# EAGLE design BLDC (EAGLE 6.2)
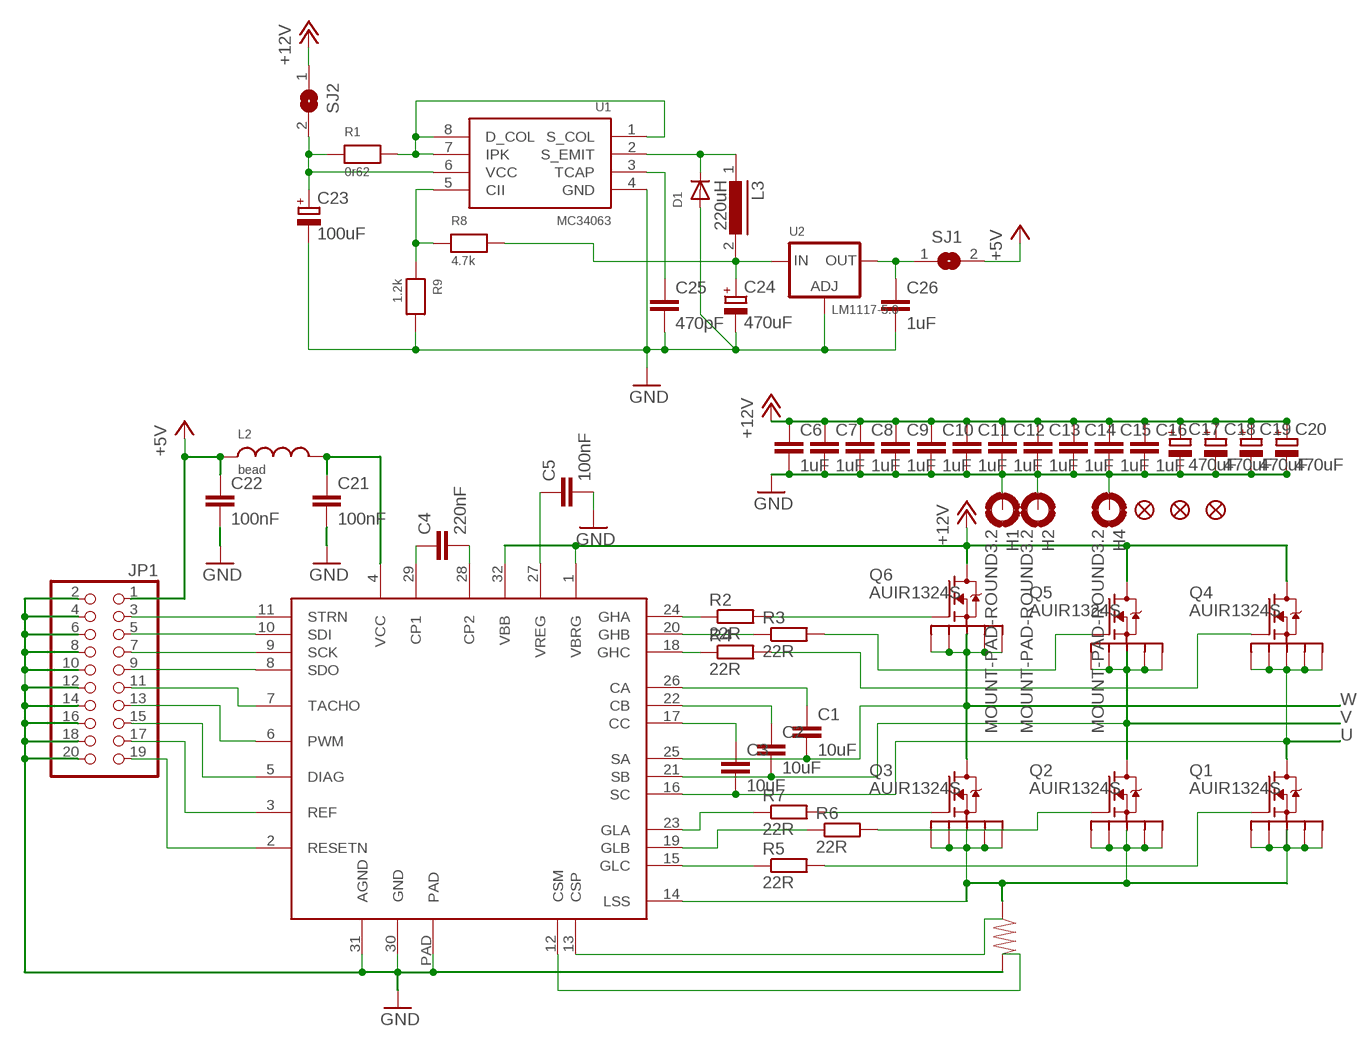
[diagram p0: schematic, sheet 1]

## Parts
C1  10uF  C-EUC0603K  [C0603K]
C2  10uF  C-EUC0603K  [C0603K]
C3  10uF  C-EUC0603K  [C0603K]
C4  220nF  C-EUC0603K  [C0603K]
C5  100nF  C-EUC0603K  [C0603K]
C6  1uF  C-EUC0603K  [C0603K]
C7  1uF  C-EUC0603K  [C0603K]
C8  1uF  C-EUC0603K  [C0603K]
C9  1uF  C-EUC0603K  [C0603K]
C10  1uF  C-EUC0603K  [C0603K]
C11  1uF  C-EUC0603K  [C0603K]
C12  1uF  C-EUC0603K  [C0603K]
C13  1uF  C-EUC0603K  [C0603K]
C14  1uF  C-EUC0603K  [C0603K]
C15  1uF  C-EUC0603K  [C0603K]
C16  1uF  C-EUC0603K  [C0603K]
C17  470uF  CPOL-EUD  [PANASONIC_D]
C18  470uF  CPOL-EUD  [PANASONIC_D]
C19  470uF  CPOL-EUD  [PANASONIC_D]
C20  470uF  CPOL-EUD  [PANASONIC_D]
C21  100nF  C-EUC0603K  [C0603K]
C22  100nF  C-EUC0603K  [C0603K]
C23  100uF  CPOL-EUD  [PANASONIC_D]
C24  470uF  CPOL-EUD  [PANASONIC_D]
C25  470pF  C-EUC0603K  [C0603K]
C26  1uF  C-EUC0603K  [C0603K]
D1  DIODESOD-123  [SOD-123]
H1  MOUNT-PAD-ROUND3.2  [3,2-PAD]
H2  MOUNT-PAD-ROUND3.2  [3,2-PAD]
H4  MOUNT-PAD-ROUND3.2  [3,2-PAD]
IC1  A4960  [LQFP32-7X7]
JP1  PINHD-2X10  [2X10]
JP2  FIDUCIAL1X2  [FIDUCIAL-1X2]
JP3  FIDUCIAL1X2  [FIDUCIAL-1X2]
JP4  FIDUCIAL1X2  [FIDUCIAL-1X2]
L2  bead  INDUCTOR0603  [0603]
L3  220uH  SLF7045  [SLF7045]
Q1  AUIR1324S  NMOSFET-D2PAK-7  [D2PAK-7]
Q2  AUIR1324S  NMOSFET-D2PAK-7  [D2PAK-7]
Q3  AUIR1324S  NMOSFET-D2PAK-7  [D2PAK-7]
Q4  AUIR1324S  NMOSFET-D2PAK-7  [D2PAK-7]
Q5  AUIR1324S  NMOSFET-D2PAK-7  [D2PAK-7]
Q6  AUIR1324S  NMOSFET-D2PAK-7  [D2PAK-7]
R1  0r62  RESISTOR0603  [0603]
R2  22R  R-EU_R0603  [R0603]
R3  22R  R-EU_R0603  [R0603]
R4  22R  R-EU_R0603  [R0603]
R5  22R  R-EU_R0603  [R0603]
R6  22R  R-EU_R0603  [R0603]
R7  22R  R-EU_R0603  [R0603]
R8  4.7k  RESISTOR0603  [0603]
R9  1.2k  RESISTOR0603  [0603]
SJ1  SOLDERJUMPERREFLOW  [SOLDERJUMPER_REFLOW]
SJ2  SOLDERJUMPERREFLOW  [SOLDERJUMPER_REFLOW]
U1  MC34063  MC34063A  [SOIC8]
U2  LM1117-5.0  LM1117SOT223-REFLOW  [SOT223-R]

## Nets
+5V: C22.1 JP1.1 L2.1 SJ1.2
+12V: C6.1 C7.1 C8.1 C9.1 C10.1 C11.1 C12.1 C13.1 C14.1 C15.1 C16.1 C17.+ C18.+ C19.+ C20.+ IC1.1(VBRG) IC1.32(VBB) Q4.D Q5.D Q6.D SJ2.1
CSM: IC1.12(CSM)
CSP: IC1.14(LSS) Q1.S1 Q1.S2 Q1.S3 Q1.S4 Q1.S5 Q2.S1 Q2.S2 Q2.S3 Q2.S4 Q2.S5 Q3.S1 Q3.S2 Q3.S3 Q3.S4 Q3.S5
GND: C5.2 C6.2 C7.2 C8.2 C9.2 C10.2 C11.2 C12.2 C13.2 C14.2 C15.2 C16.2 C17.- C18.- C19.- C20.- C21.2 C22.2 C23.- C24.- C25.2 C26.2 D1.A H1.B3,2(MOUNT) H2.B3,2(MOUNT) H4.B3,2(MOUNT) IC1.30(GND) IC1.31(AGND) IC1.PAD JP1.2 JP1.4 JP1.6 JP1.8 JP1.10 JP1.12 JP1.14 JP1.16 JP1.18 JP1.20 R9.2 U1.4(GND) U2.1(ADJ)
N$1: IC1.13(CSP)
N$2: Q6.G R2.2
N$3: IC1.11(STRN) JP1.3
N$4: IC1.10(SDI) JP1.5
N$5: IC1.9(SCK) JP1.7
N$6: Q3.G R7.2
N$7: Q2.G R6.2
N$8: Q1.G R5.2
N$9: IC1.24(GHA) R2.1
N$10: Q5.G R3.2
N$11: Q4.G R4.2
N$12: IC1.20(GHB) R3.1
N$13: IC1.18(GHC) R4.1
N$14: IC1.23(GLA) R7.1
N$15: C1.1 IC1.26(CA)
N$16: C2.1 IC1.22(CB)
N$17: C3.1 IC1.17(CC)
N$18: C4.1 IC1.29(CP1)
N$19: C4.2 IC1.28(CP2)
N$20: IC1.19(GLB) R6.1
N$21: IC1.15(GLC) R5.1
N$22: C5.1 IC1.27(VREG)
N$23: C21.1 IC1.4(VCC) L2.2
N$24: R1.2 U1.1(S_COL) U1.7(IPK) U1.8(D_COL)
N$25: D1.C L3.1 U1.2(S_EMIT)
N$26: IC1.8(SDO) JP1.9
N$27: IC1.7(TACHO) JP1.11
N$28: IC1.6(PWM) JP1.13
N$29: IC1.5(DIAG) JP1.15
N$30: IC1.3(REF) JP1.17
N$31: IC1.2(RESETN) JP1.19
N$32: C24.+ L3.2 R8.2 U2.3(IN)
N$33: C26.1 SJ1.1 U2.2(OUT)
N$34: C23.+ R1.1 SJ2.2 U1.6(VCC)
N$35: C25.1 U1.3(TCAP)
N$36: R8.1 R9.1 U1.5(CII)
U: C3.2 IC1.16(SC) Q1.D Q4.S1 Q4.S2 Q4.S3 Q4.S4 Q4.S5
V: C2.2 IC1.21(SB) Q2.D Q5.S1 Q5.S2 Q5.S3 Q5.S4 Q5.S5
W: C1.2 IC1.25(SA) Q3.D Q6.S1 Q6.S2 Q6.S3 Q6.S4 Q6.S5

## Library data of the parts
C1-C16 C21 C22 C25 C26 = rcl:C-EU: CAPACITOR, European symbol
C17-C20 C23 C24 = rcl:CPOL-EU: POLARIZED CAPACITOR, European symbol
D1 = microbuilder:DIODE: Diode SMADIODE - SMA Surface Mount Package 20V 1A Schottky Diode Digikey (500mV @ 1A, 500uA Vr @ 20V): 641-1014-6-ND SOD-123 30V 500mA (430mV Vf, 130uA Vr @ 30V) Schottky Diode - Digikey: B0530W-FDICT-ND SOD-323 10V 570mA (380mV Vf, 3ns) Schottky Diode - Digikey: ZLLS410CT-ND SOD-523 30V 30mA Schottky Diode (RB751S-40TE61) - Digikey: RB751S-40TE61CT-ND SOT23-R/W - SOT23 Package (R = Solder Paste/Reflow Ovens, W = Hand-Soldering) BAT54Film 40V 300mA - Digikey: 497-7162-1-ND DO-1N4148 Through Hole Small Current Diode (any model)
H1 H2 H4 = holes:MOUNT-PAD-ROUND: MOUNTING PAD, round
IC1 = A4960:A4960
JP1 = pinhead:PINHD-2X10: PIN HEADER
JP2-JP4 = SparkFun:FIDUCIAL: Fiducial Alignment Points Various fiducial points for machine vision alignment.
L2 = microbuilder:INDUCTOR: Inductors 0603: 10nH Ceramic Inductor - microwire antenna/RF (Digikey: 712-1434-2-ND) 0805: 560nH Ceramic Inductor - RF (Digikey: 553-1047-1-ND) 1007 (2518 Metric) SMT: 10µH 10% 250mOhm 820mA 1007 Inductor (Digikey: 587-2189-1-ND) 22µH 10% 500mOhm 580mA 1007 Inductor (Digikey: 587-2190-1-ND) 47µH 10% 950mOhm 420mA 1007 Inductor (Digikey: 587-2191-1-ND) 47µH 5% 100mOhm 1A 1008 Inductor (Digikey: 732-1816-1-ND)
L3 = inductors:SLF7045: SMD Inductors(Coils) For Power Line (Wound, Magnetic Shielded) Source: TDK, e531_slf7045.pdf
Q1-Q6 = D2PAK-7:NMOSFET-D2PAK-7
R1 R8 R9 = microbuilder:RESISTOR: Resistors 0402 - 0402 Surface Mount Package 10.0K 1% 1/16W [Digikey: 311-10.0KLRTR-ND] 0603 - 0603 Surface Mount Package 0 Ohm 1/10 Watt 1% Resistor 15 Ohm 1/10 Watt 1% Resistor 33 Ohm 1/10 Watt 1% Resistor 49.9 Ohm 1/10 Watt 1% Resistor 100 Ohm 1/10 Watt 1% Resistor 150 Ohm 1/10 Watt 1% Resistor 240 Ohm 1/10 Watt 1% Resistor 390 Ohm 1/10 Watt 1% Resistor 560 Ohm 1/10 Watt 1% Resistor 750 Ohm 1/10 Watt 1% Resistor 1.0K Ohm 1/10 Watt 1% Resistor 1.5K Ohm 1/10 Watt 1% Resistor 2.0K Ohm 1/10 Watt 1% Resistor 4.7K Ohm 1/10 Watt 1% Resistor 10.0K Ohm 1/10 Watt 1% Resistor 20.0K Ohm 1/10 Watt 1% Resistor 33.0K Ohm 1/10 Watt 1% Resistor 100.0K Ohm 1/10 Watt 1% Resistor 0805 - 0805 Surface Mount Package 0 Ohm 1/8 Watt 1% Resistor 33 Ohm 1/8 Watt 1% Resistor 100 Ohm 1/8 Watt 1% Resistor 150 Ohm 1/8 Watt 1% Resistor 200 Ohm 1/8 Watt 1% Resistor 240 Ohm 1/8 Watt 1% Resistor 330 Ohm 1/8 Watt 1% Resistor 390 Ohm 1/8 Watt 1% Resistor 470 Ohm 1/8 Watt 1% Resistor 1.0K Ohm 1/8 Watt 1% Resistor 1.5K Ohm 1/8 Watt 1% Resistor 2.0K Ohm 1/8 Watt 1% Resistor 4.7K Ohm 1/8 Watt 1% Resistor 5.1K Ohm 1/8 Watt 1% Resistor 5.6K Ohm 1/8 Watt 1% Resistor 10.0K Ohm 1/8 Watt 1% Resistor 22.0K Ohm 1/8 Watt 1% Resistor 33.0K Ohm 1/8 Watt 1% Resistor 100K Ohm 1/8 Watt 1% Resistor 1206 - 1206 Surface Mount Package
R2-R7 = rcl:R-EU_: RESISTOR, European symbol
SJ1 SJ2 = microbuilder:SOLDERJUMPER: SMD Solder JUMPER Solder the two pads together to create a connection, or remove the solder to break it. REFLOW - Use this footprint for solder paste and reflow ovens. WAVE - Use this footprint for hand-soldering (larger pads).
U1 = microbuilder:MC34063A: MC34063A - 1.5A 3V-40V Boost/Buck/Inverting Voltage Regulator [Part No.] Allows you to 'boost', reduce or invert the voltage of your power supply to a more appropriate level. Common voltage regulators like the LM1117 are easy to use, but they can only 'reduce' the voltage level and require more volts than they provide, making them useless for low voltage power supplies like batteries or solar panels. A 'Step-Up' regulator like the MC34063A solves this problem by also allowing you to increase the voltage to a pre-determined level, though you still need to pay attention to the minimum voltage level the converter can handle, keeping in mind that many 'step-up' converts are less efficient at the two extreme ends of their working range. Given that many step-up circuits introduce some ripple to the power supply, you can often get a much 'smoother' supply by boosting the voltage up to 5.0V and then using a standard fixed voltage regulator (such as the common LM1117, etc.) to drop the voltage back down to 3.3V. This may not be necessary, and some step up regulators can provide a smooth supply on their own, but it's worth keeping in mind if you do encounter some ripple in the power supply using only a step-up IC for your power supply. Texas Instruments MC34063A Digikey: 296-17765-1-ND
U2 = microbuilder:LM1117: LM1117 Voltage Regulator LM1117 Adjustable Voltage regulator [Digikey: LM1117IMP-ADJDKR-ND] LM1117 3.3V Voltage regulator [AP1117E33GDIDKR-ND] LM1117 5.0V Voltage regulator [AP1117E50GDIDKR-ND] SOT223-REFLOW - SOT223 package for solder paste/reflow ovens SOT223-WAVE - SOT223 package for hand-soldering (larger pads) Note: For the fixed-voltage regulators, simply set the ADJ pin to GND.

## Board
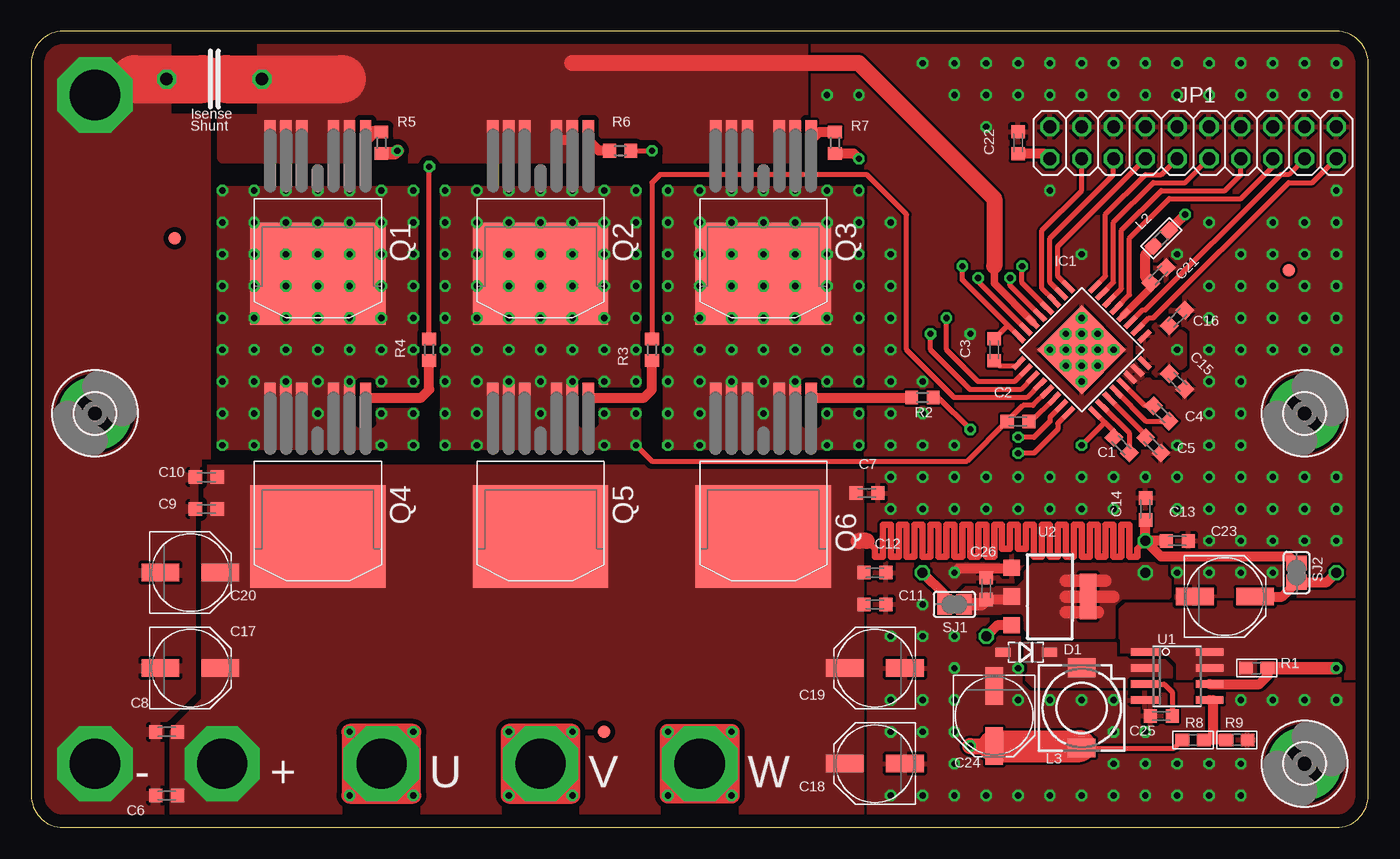
[diagram p1: board, top side]
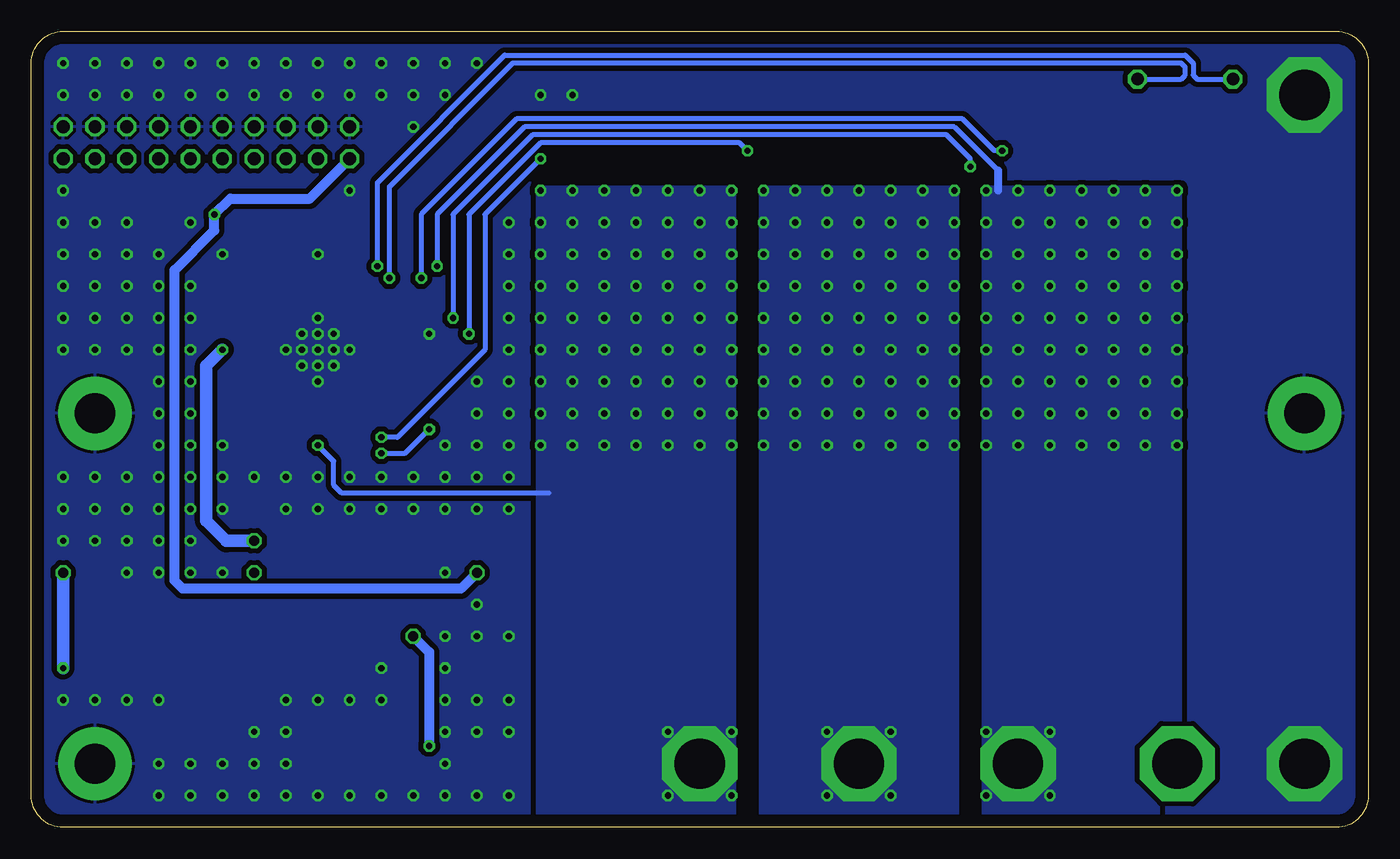
[diagram p2: board, bottom side, seen from below]

Size 106.68 x 63.5 mm. Coordinates in mm from the lower left corner, seen from the top.
Outline: 104.14,63.5 2.54,63.5 arc90 0,60.96 0,2.54 arc90 2.54,0 104.14,0 arc90 106.68,2.54 106.68,60.96 arc90 104.14,63.5
Copper layers (1*16): Top 0.035mm / dielectric 1.5mm / Bottom 0.035mm
Design rules: minimum track width 10mil, minimum drill 0.5mm, track to track 8mil, track to pad 8mil, pad to pad 8mil, via to via 8mil, smd to smd 8mil, copper to edge 40mil, drill to drill 8mil, minimum pad ring 10mil, minimum via ring 8mil, stop-mask expansion 4mil, vias tented up to drill 0.55mm, thermal gap 10mil

### Footprints (pad centres in the part's own frame; a part is rotated, then mirrored left to right if it is on the bottom)
C0603K = smd 1.05 x 1.08: 1 -0.875,0; 2 0.875,0
PANASONIC_D = smd 3 x 1.4: + 2.4,0; - -2.4,0
SOD-123 = smd 1.2 x 0.7: A 1.85,0; C -1.85,0
3,2-PAD = drill 3.2 pad 5.842: B3,2 0,0
LQFP32-7X7 = smd 1.2 x 0.4: 1 -4.3,2.8; 2 -4.3,2; 3 -4.3,1.2; 4 -4.3,0.4; 5 -4.3,-0.4; 6 -4.3,-1.2; 7 -4.3,-2; 8 -4.3,-2.8; 17 4.3,-2.8; 18 4.3,-2; 19 4.3,-1.2; 20 4.3,-0.4; 21 4.3,0.4; 22 4.3,1.2; 23 4.3,2; 24 4.3,2.8 | smd 0.4 x 1.2: 9 -2.8,-4.3; 10 -2,-4.3; 11 -1.2,-4.3; 12 -0.4,-4.3; 13 0.4,-4.3; 14 1.2,-4.3; 15 2,-4.3; 16 2.8,-4.3; 25 2.8,4.3; 26 2,4.3; 27 1.2,4.3; 28 0.4,4.3; 29 -0.4,4.3; 30 -1.2,4.3; 31 -2,4.3; 32 -2.8,4.3 | smd 5 x 5: PAD 0,0
2X10 = drill 1.016 octagon: 1 -11.43,-1.27; 2 -11.43,1.27; 3 -8.89,-1.27; 4 -8.89,1.27; 5 -6.35,-1.27; 6 -6.35,1.27; 7 -3.81,-1.27; 8 -3.81,1.27; 9 -1.27,-1.27; 10 -1.27,1.27; 11 1.27,-1.27; 12 1.27,1.27; 13 3.81,-1.27; 14 3.81,1.27; 15 6.35,-1.27; 16 6.35,1.27; 17 8.89,-1.27; 18 8.89,1.27; 19 11.43,-1.27; 20 11.43,1.27
FIDUCIAL-1X2 = smd 1 x 1: 1 0,0
0603 = smd 1.1 x 1: 1 -0.85,0; 2 0.85,0
SLF7045 = smd 1.5 x 2.2: 1 -3.2,0; 2 3.2,0
D2PAK-7 = smd 10.8 x 8.15: D 0,4.1 | smd 0.9 x 3.2: G -3.81,-6.56; S1 -2.54,-6.56; S2 -1.27,-6.56; S3 1.27,-6.56; S4 2.54,-6.56; S5 3.81,-6.56
R0603 = smd 1 x 1.1: 1 -0.85,0; 2 0.85,0
SOLDERJUMPER_REFLOW = smd 1.168 x 1.6: 1 -0.762,0; 2 0.762,0
SOIC8 = smd 0.6 x 2.2: 1 -1.905,-2.6; 2 -0.635,-2.6; 3 0.635,-2.6; 4 1.905,-2.6; 5 1.905,2.6; 6 0.635,2.6; 7 -0.635,2.6; 8 -1.905,2.6
SOT223-R = smd 1.3 x 1.3: 1 -2.3,-3.05; 2 0,-3.05; 3 2.3,-3.05 | smd 3.6 x 1.3: 4 0,3.05

### Placement (x,y rotation side)
C1  87,30.48 135 top
C2  78.74,32.38 180 top
C3  76.83,38.1 90 top
C4  90.17,33.02 315 top
C5  89.53,30.48 315 top
C6  10.79,2.54 180 top
C7  66.67,26.67 0 top
C8  10.79,7.62 180 top
C9  13.97,25.4 180 top
C10  13.97,27.94 180 top
C11  67.31,17.78 0 top
C12  67.31,20.32 0 top
C13  91.44,22.86 0 top
C14  88.9,25.4 90 top
C15  91.44,35.56 315 top
C16  91.44,40.64 45 top
C17  12.7,12.7 0 top
C18  67.31,5.08 180 top
C19  67.31,12.7 180 top
C20  12.7,20.32 0 top
C21  89.95,44.04 45 top
C22  78.74,54.61 90 top
C23  95.25,18.41 0 top
C24  76.83,8.89 270 top
C25  90.17,8.89 180 top
C26  76.2,19.05 90 top
D1  79.38,13.97 180 top
H1  5.08,33.02 0 top
H2  101.6,5.08 0 top
H4  101.6,33.02 0 top
IC1  83.82,38.1 225 top
JP1  92.71,54.61 0 top
JP2  100.33,44.45 0 top
JP3  45.72,7.62 0 top
JP4  11.43,46.99 0 top
L2  90.17,46.99 225 top
L3  83.82,9.53 270 top
Q1  22.86,48.26 180 top
Q2  40.64,48.26 180 top
Q3  58.42,48.26 180 top
Q4  22.86,27.3 180 top
Q5  40.64,27.3 180 top
Q6  58.42,27.3 180 top
R1  97.79,12.7 180 top
R2  71.12,34.29 180 top
R3  49.53,38.1 270 top
R4  31.75,38.1 270 top
R5  27.94,54.61 90 top
R6  46.99,53.98 180 top
R7  64.14,54.61 90 top
R8  92.71,6.99 180 top
R9  96.2,6.99 0 top
SJ1  73.66,17.78 180 top
SJ2  100.97,20.32 270 top
U1  91.44,12.06 270 top
U2  81.28,18.41 270 top

### Tracks (layer width: path | path; a pad name or v marks a point on that pad's centre or on a via)
+5V  (via drill 0.5, 0.8)
  Top 0.813: L2.1 v92.08,48.9 | JP1.1 80.89,53.73 C22.1 | SJ1.2 72.9,18.54 v71.12,20.32
  Bottom 0.813: v71.12,20.32 72.39,19.05 94.61,19.05 95.25,19.68 95.25,44.45 92.08,47.62 v92.08,48.9 90.81,50.16 84.45,50.16 JP1.1
+12V  (via drill 0.5, 0.8, 4 pad 6)
  Top 0.508: v88.9,22.86 88.27,22.23 88.27,21.59 87.63,21.59 87.63,24.13 87,24.13 87,21.59 86.36,21.59 86.36,24.13 85.72,24.13 85.72,21.59 85.09,21.59 85.09,24.13 84.45,24.13 84.45,21.59 83.82,21.59 83.82,24.13 83.19,24.13 83.19,21.59 82.55,21.59 82.55,24.13 81.92,24.13 81.92,21.59 81.28,21.59 81.28,24.13 80.64,24.13 80.64,21.59 80.01,21.59 80.01,24.13 79.38,24.13 79.38,22.23 78.74,22.23 78.74,24.13 78.11,24.13 78.11,22.23 77.47,22.23 77.47,24.13 76.83,24.13 76.83,21.59 76.2,21.59 76.2,24.13 75.56,24.13 75.56,21.59 74.93,21.59 74.93,24.13 74.3,24.13 74.3,21.59 73.66,21.59 73.66,24.13 73.03,24.13 73.03,21.59 72.39,21.59 72.39,24.13 71.75,24.13 71.75,21.59 71.12,21.59 71.12,24.13 70.48,24.13 70.48,21.59 69.85,21.59 69.85,24.13 69.22,24.13 69.22,21.59 68.58,21.59 68.58,24.13 67.94,24.13 67.94,21.59 67.31,21.59 67.31,22.23 66.67,22.86
  Top 0.813: SJ2.1 100.84,21.08 100.33,21.59 90.17,21.59 v88.9,22.86 | v88.9,22.86 C14.1 | C13.1 v88.9,22.86
  Top 1.27: 66.67,22.86 66.04,22.86
  Bottom 1.016: v88.9,22.86 91.12,22.86 92.71,24.45 92.71,36.83 v91.44,38.1
  other vias: 15.24,5.08
  pour Top (isolate 0.406, no thermals): 66.04,28.57 66.04,0 11.43,0 11.43,7.62 13.97,10.16 13.97,28.57
  pour Top (rank 5): 90.17,35.56 88.27,37.47 88.27,38.73 90.17,40.64 92.08,39.37 92.08,36.83
CSM  (via drill 0.5)
  Top 0.406: IC1.12 79.06,43.43 v79.06,44.77
  Bottom 0.406: 10.86,59.69 13.65,59.69 13.97,60.01 13.97,60.96 14.61,61.59 68.9,61.59 79.06,51.44 v79.06,44.77
CSP
  Top 0.61: IC1.14 76.83,43.39 76.83,44.77
  Top 0.813: Q2.S1 Q2.S2
  Top 1.27: 43.18,60.96 66.04,60.96 76.83,50.16 76.83,44.77
  Top 3.81: 15.56,59.69 24.77,59.69
  pour Top (isolate 0.406, no thermals): 61.59,53.34 15.24,53.34 15.24,56.52 18.41,56.52 18.41,63.5 61.59,63.5
GND  (via drill 0.5, 4 pad 6)
  Top 0.813: 78.11,20.64 73.98,20.64 v73.66,20.32
  Top 3.81: 8.26,59.69 13.65,59.69
  other vias: 68.58,45.72 68.58,48.26 68.58,43.18 68.58,40.64 68.58,38.1 74.93,39.37 93.98,43.18 93.98,40.64 93.98,38.1 83.82,40.64 81.28,38.1 82.55,39.37 83.82,38.1 85.09,39.37 86.36,38.1 85.09,36.83 83.82,35.56 82.55,36.83 68.58,35.56 68.58,33.02 68.58,30.48 71.12,30.48 71.12,33.02 73.66,30.48 71.12,25.4 73.66,25.4 76.2,25.4 78.74,25.4 81.28,25.4 83.82,25.4 83.82,27.94 86.36,27.94 86.36,25.4 93.98,27.94 93.98,30.48 93.98,33.02 93.98,35.56 93.98,25.4 93.98,22.86 71.12,17.78 71.12,15.24 68.58,15.24 96.52,22.86 96.52,25.4 96.52,27.94 96.52,30.48 96.52,33.02 96.52,35.56 96.52,38.1 96.52,40.64 96.52,43.18 96.52,45.72 99.06,45.72 99.06,48.26 99.06,43.18 99.06,40.64 99.06,38.1 99.06,22.86 71.12,10.16 68.58,10.16 68.58,7.62 71.12,7.62 71.12,2.54 68.58,2.54 104.14,10.16 101.6,22.86 104.14,22.86 101.6,38.1 104.14,38.1 101.6,40.64 104.14,40.64 101.6,48.26 104.14,48.26 104.14,45.72 101.6,45.72 101.6,43.18 104.14,43.18 93.98,60.96 91.44,60.96 96.52,60.96 86.36,60.96 83.82,60.96 88.9,60.96 78.74,60.96 76.2,60.96 81.28,60.96 73.66,60.96 83.82,39.37 82.55,38.1 83.82,36.83 85.09,38.1 91.44,45.72 91.44,20.32 73.66,5.08 73.66,2.54 76.2,2.54 78.74,2.54 81.28,2.54 83.82,2.54 86.36,2.54 86.36,5.08 88.9,5.08 88.9,2.54 91.44,2.54 93.98,2.54 96.52,2.54 96.52,5.08 96.52,10.16 88.9,27.94 93.98,20.32 96.52,20.32 99.06,20.32 101.6,10.16 99.06,10.16 99.06,27.94 99.06,25.4 101.6,25.4 101.6,27.94 104.14,27.94 104.14,25.4 78.74,10.16 81.28,10.16 83.82,10.16 73.66,15.24 73.66,12.7 73.66,10.16 73.66,7.62 78.74,12.7 86.36,7.62 86.36,10.16 5.08,5.08 91.44,30.48 91.44,27.94 68.58,25.4 93.98,48.26 81.28,50.8 96.52,58.42 93.98,58.42 88.9,58.42 86.36,58.42 91.44,58.42 81.28,58.42 78.74,58.42 83.82,58.42 76.2,58.42 104.14,50.8 83.82,45.72 68.58,27.94 71.12,27.94 73.66,27.94 76.2,27.94 78.74,27.94 71.12,35.56 101.6,60.96 99.06,60.96 104.14,60.96 104.14,58.42 101.6,58.42 99.06,58.42 76.2,55.88 73.66,58.42 71.12,60.96 66.04,58.42 63.5,58.42 81.28,27.94 91.44,5.08 93.98,5.08 88.9,7.62 91.44,25.4 5.08,58.42
  pour Top (isolate 0.406, rank 6): 0,0 13.97,0 13.97,56.52 10.79,56.52 10.79,63.5 0,63.5
  pour Bottom (isolate 0.406, rank 5): 0,0 106.68,0 106.68,63.5 0,63.5
  pour Top (rank 6): 60.96,63.5 106.68,63.5 106.68,0 60.96,0
  pour Top (isolate 0.254, no thermals): 75.56,14.61 78.74,14.61 78.74,8.89 75.56,8.89
N$1  (via drill 0.5)
  Top 0.406: IC1.13 78.11,43.25 v78.11,43.81
  Bottom 0.406: 18.35,59.69 14.92,59.69 14.61,60.01 14.61,60.64 14.92,60.96 68.26,60.96 78.11,51.12 v78.11,43.81
N$2
  Top 0.813: R2.2 62.44,34.29 Q6.G
N$3
  Top 0.406: IC1.11 80.64,42.97 80.64,47.62 83.82,50.8 JP1.3
N$4
  Top 0.406: IC1.10 81.28,43.47 81.28,46.99 86.36,52.07 JP1.5
N$5
  Top 0.406: IC1.9 81.92,43.97 81.92,46.35 JP1.7
N$6
  Top 0.813: R7.2 62.87,55.46 Q3.G
N$7
  Top 0.813: R6.2 45.3,53.98 Q2.G
N$8
  Top 1.016: R5.2 27.31,55.46 Q1.G
N$9  (via drill 0.5)
  Top 0.406: IC1.24 81.92,32.23 81.92,31.75 80.01,29.84 v78.74,29.84 | v74.93,31.75 72.39,34.29 R2.1
  Bottom 0.406: v78.74,29.84 76.83,29.84 v74.93,31.75
N$10
  Top 0.813: R3.2 49.53,34.92 48.9,34.29 44.45,34.29 Q5.G
N$11
  Top 0.813: R4.2 31.75,34.92 31.11,34.29 26.67,34.29 Q4.G
N$12
  Top 0.406: R3.1 49.53,51.44 50.16,52.07 66.67,52.07 69.85,48.9 69.85,38.1 73.66,34.29 79.44,34.29 IC1.20
N$13  (via drill 0.5)
  Top 0.406: R4.1 v31.75,52.7 | IC1.18 78.45,35.56 75.56,35.56 73.03,38.1 v73.03,40.64
  Bottom 0.406: v31.75,52.7 31.75,53.34 33.66,55.24 66.67,55.24 73.03,48.9 v73.03,40.64
N$14  (via drill 0.5)
  Top 0.406: IC1.23 81.28,32.73 81.28,32.38 80.01,31.11 v78.74,31.11
  Top 0.813: R7.1 65.62,53.76 v66.04,53.34
  Bottom 0.406: v66.04,53.34 70.48,48.9 70.48,38.1 77.47,31.11 v78.74,31.11
N$15
  Top 0.406: IC1.26 87.61,31.48 C1.1
N$16
  Top 0.406: IC1.22 79.8,32.38 C2.1
N$17
  Top 0.406: IC1.17 78.59,36.83 77.23,36.83 C3.1
N$18
  Top 0.406: C4.1 89.53,33.66 88.83,33.66 IC1.29
N$19
  Top 0.406: IC1.28 88.95,32.4 C4.2
N$20  (via drill 0.5)
  Top 0.406: R6.1 v49.53,53.98 | IC1.19 78.95,34.92 74.93,34.92 71.75,38.1 v71.75,39.37
  Bottom 0.406: v49.53,53.98 50.16,54.61 66.04,54.61 71.75,48.9 v71.75,39.37
N$21  (via drill 0.5)
  Top 0.406: IC1.15 75.56,43.53 v75.56,43.81
  Top 1.016: R5.1 29,53.76 v29.21,53.98
  Bottom 0.406: v29.21,53.98 29.84,53.98 32.38,56.52 67.94,56.52 75.56,48.9 v75.56,43.81
N$22
  Top 0.406: IC1.27 88.49,31.73 88.92,31.31 C5.1
N$23
  Top 0.406: 89.33,43.04 C21.1
  Top 0.61: IC1.4 89.33,43.04
  Top 0.813: C21.1 88.9,43.85 88.9,45.72 L2.2
N$24
  pour Top (isolate 0.254, rank 5, no thermals): 87,17.78 106.68,17.78 106.68,12.06 90.81,12.06 89.53,13.34 87,13.34
N$25
  Top 1.27: 83.84,12.7 L3.1
  pour Top (isolate 0.254, rank 4, no thermals): 79.38,14.61 79.38,12.06 80.01,11.43 90.17,11.43 90.81,12.06 90.81,12.7 90.17,13.34 86.36,13.34 86.36,14.61
N$26
  Top 0.406: IC1.8 85.72,43.97 85.72,48.9 88.9,52.07 90.17,52.07 JP1.9
N$27
  Top 0.406: IC1.7 86.36,43.47 86.36,48.26 89.53,51.44 92.08,51.44 JP1.11
N$28
  Top 0.406: IC1.6 87,42.97 87,47.62 90.17,50.8 95.25,50.8 96.52,52.07 JP1.13
N$29
  Top 0.406: IC1.5 87.63,42.48 87.63,46.99 90.81,50.16 96.52,50.16 99.06,52.7 JP1.15
N$30
  Top 0.406: IC1.3 88.69,41.27 88.9,41.27 99.69,52.07 100.33,52.07 JP1.17
N$31
  Top 0.406: IC1.2 89.19,40.64 89.53,40.64 100.33,51.44 102.23,51.44 JP1.19
N$32  (via drill 0.5, 0.8)
  Top 0.406: L3.2 91.2,6.33 R8.2
  Top 0.813: U2.3 77.08,16.11 v76.2,15.24
  Top 1.27: v74.93,6.49 C24.+
  Top 1.422: 83.66,6.49 L3.2
  Top 2.54: C24.+ 83.66,6.49
  Bottom 0.813: v74.93,6.49 74.93,13.97 v76.2,15.24
N$33  (via drill 0.8)
  Top 0.813: U2.2 77.99,18.18 C26.1
  Top 1.016: 82.55,19.68 85.72,19.68 | SJ1.1 75.81,17.78 C26.1 | 82.55,18.41 86.36,18.41 | 82.55,17.14 85.09,17.14
  other vias: 88.9,20.32
  pour Top (isolate 0.254, rank 2, no thermals): 73.98,18.41 73.98,17.14 78.74,17.14 79.38,16.51 79.38,15.88 80.01,15.24 86.36,15.24 86.36,17.78 87,18.41 90.81,18.41 90.81,20.95 80.01,20.95 79.38,20.32 79.38,19.68 78.74,19.05 74.61,19.05
N$34  (via drill 0.5, 0.8)
  Top 0.813: U1.6 98,11.43 98.64,12.06 R1.1 | C23.+ 99.82,18.41 SJ2.2 103.38,19.56 v104.14,20.32
  Top 1.016: R1.1 v104.14,12.7
  Bottom 1.016: v104.14,12.7 v104.14,20.32
N$35
  Top 0.406: U1.3 90.41,11.43 91.05,10.79 C25.1
N$36
  Top 0.813: U1.5 94.3,10.16 94.3,6.99 | 94.3,6.99 R8.1 | R9.1 94.3,6.99
N$38  (via drill 1)
  other vias: 10.79,59.69
N$39  (via drill 1)
  other vias: 18.41,59.69
U  (via drill 0.5, 4 pad 6)
  Top 0.406: IC1.16 78.03,39.93 | 78.03,39.93 74.3,43.66 v74.3,44.77 | C3.2 77.79,39.93 78.03,39.93
  Top 1.27: v30.48,2.54 v30.48,7.62 v25.4,7.62 v25.4,2.54 v30.48,2.54
  Bottom 0.406: v74.3,44.77 74.3,48.9 67.31,55.88 33.02,55.88 29.53,52.39
  Bottom 0.635: 29.53,50.8 29.53,52.39
  other vias: 20.32,38.1 20.32,40.64 22.86,40.64 27.94,40.64 20.32,43.18 27.94,43.18 20.32,45.72 22.86,45.72 27.94,45.72 20.32,48.26 22.86,48.26 27.94,48.26 22.86,38.1 27.94,38.1 27.94,5.08 30.48,40.64 30.48,38.1 30.48,43.18 30.48,45.72 30.48,48.26 17.78,40.64 17.78,38.1 17.78,35.56 22.86,35.56 30.48,35.56 22.86,33.02 17.78,30.48 17.78,33.02 20.32,35.56 20.32,33.02 15.24,33.02 15.24,30.48 15.24,35.56 15.24,38.1 15.24,40.64 17.78,43.18 17.78,45.72 15.24,43.18 15.24,45.72 17.78,48.26 15.24,48.26 30.48,33.02 30.48,30.48 22.86,30.48 27.94,30.48 20.32,30.48 25.4,38.1 25.4,40.64 25.4,43.18 25.4,45.72 25.4,48.26 15.24,50.8 17.78,50.8 20.32,50.8 22.86,50.8 25.4,50.8 27.94,50.8 30.48,50.8 25.4,30.48 27.94,35.56 27.94,33.02 22.86,43.18 25.4,35.56 25.4,33.02
  pour Top (isolate 0.406, no thermals): 30.48,30.48 15.24,30.48 15.24,50.8 30.48,50.8
  pour Bottom (isolate 0.406, no thermals): 30.48,0 15.24,0 15.24,50.8 30.48,50.8
V  (via drill 0.5, 4 pad 6)
  Top 0.406: v48.26,30.48 49.53,29.21 74.69,29.21 C2.2 79.14,33.66 79.94,33.66 IC1.21
  Top 1.27: v43.18,2.54 v43.18,7.62 v38.1,7.62 v38.1,2.54 v43.18,2.54
  other vias: 35.56,38.1 35.56,40.64 40.64,40.64 45.72,40.64 45.72,43.18 35.56,43.18 40.64,45.72 35.56,45.72 45.72,45.72 35.56,48.26 40.64,48.26 45.72,48.26 40.64,38.1 45.72,38.1 40.64,5.08 40.64,35.56 40.64,33.02 33.02,33.02 33.02,30.48 33.02,38.1 33.02,35.56 35.56,35.56 33.02,40.64 33.02,43.18 33.02,45.72 33.02,48.26 48.26,40.64 48.26,38.1 48.26,35.56 48.26,43.18 48.26,45.72 48.26,48.26 40.64,30.48 35.56,30.48 35.56,33.02 45.72,30.48 48.26,33.02 38.1,48.26 38.1,45.72 38.1,43.18 38.1,40.64 38.1,38.1 38.1,35.56 43.18,38.1 43.18,40.64 43.18,43.18 43.18,45.72 43.18,48.26 33.02,50.8 35.56,50.8 38.1,50.8 40.64,50.8 43.18,50.8 45.72,50.8 48.26,50.8 43.18,30.48 38.1,33.02 38.1,30.48 45.72,35.56 45.72,33.02 40.64,43.18 43.18,35.56 43.18,33.02
  pour Top (isolate 0.406, no thermals): 48.26,30.48 33.02,30.48 33.02,50.8 48.26,50.8
  pour Bottom (isolate 0.406, no thermals): 48.26,0 33.02,0 33.02,50.8 48.26,50.8
W  (via drill 0.5, 4 pad 6)
  Top 0.406: IC1.25 85.65,32.31 | 85.65,32.31 86.38,31.58 C1.2 | v83.82,30.48 85.65,32.31
  Top 1.27: v50.8,7.62 v55.88,7.62 v55.88,2.54 v50.8,2.54 v50.8,7.62
  Bottom 0.406: 65.41,26.67 81.92,26.67 82.55,27.3 82.55,29.21 v83.82,30.48
  other vias: 53.34,38.1 53.34,45.72 58.42,45.72 60.96,45.72 60.96,43.18 53.34,43.18 53.34,40.64 58.42,40.64 60.96,40.64 60.96,48.26 58.42,48.26 53.34,48.26 58.42,38.1 60.96,38.1 53.34,5.08 58.42,35.56 58.42,33.02 53.34,35.56 53.34,33.02 50.8,33.02 50.8,35.56 50.8,38.1 50.8,40.64 50.8,43.18 50.8,45.72 50.8,48.26 63.5,40.64 63.5,38.1 63.5,43.18 63.5,45.72 63.5,48.26 63.5,35.56 63.5,33.02 63.5,30.48 60.96,30.48 58.42,30.48 53.34,30.48 50.8,30.48 66.04,40.64 66.04,43.18 66.04,45.72 66.04,48.26 66.04,38.1 66.04,35.56 66.04,33.02 66.04,30.48 55.88,35.56 55.88,38.1 55.88,40.64 55.88,43.18 55.88,45.72 55.88,48.26 50.8,50.8 53.34,50.8 55.88,50.8 58.42,50.8 60.96,50.8 63.5,50.8 66.04,50.8 55.88,33.02 55.88,30.48 58.42,43.18 60.96,35.56 60.96,33.02
  pour Top (isolate 0.406, no thermals): 66.04,30.48 50.8,30.48 50.8,50.8 66.04,50.8
  pour Bottom (isolate 0.406, no thermals): 66.04,0 50.8,0 50.8,50.8 66.04,50.8

### Text on the board
_tsilk: Isense | Shunt | - | + | U | V | W
_bsilk: BLDC Motor Driver | by Triffid Hunter | http://github.com/triffid/BLDC